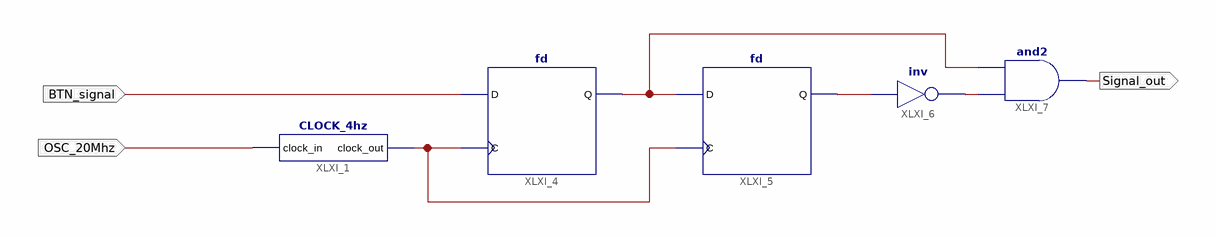
[diagram p0: schematic sheet 1]
// Xilinx ISE schematic debouncing_btn.sch (spartan6) as structural Verilog: 5 symbols, 3 ports
module debouncing_btn (
  input  OSC_20Mhz,
  input  BTN_signal,
  output Signal_out
);

  wire XLXN_2, XLXN_5, XLXN_6, XLXN_7;

  CLOCK_4hz XLXI_1 (.clock_in(OSC_20Mhz), .clock_out(XLXN_2));
  fd XLXI_4 (.C(XLXN_2), .D(BTN_signal), .Q(XLXN_5));
  fd XLXI_5 (.C(XLXN_2), .D(XLXN_5), .Q(XLXN_6));
  not XLXI_6 (XLXN_7, XLXN_6);
  and XLXI_7 (Signal_out, XLXN_7, XLXN_5);
endmodule
